# EAGLE design ASL1003 (EAGLE 6.3)
DATABASE: ./../../../../../Components/TinyCircuits_Part_Database.txt
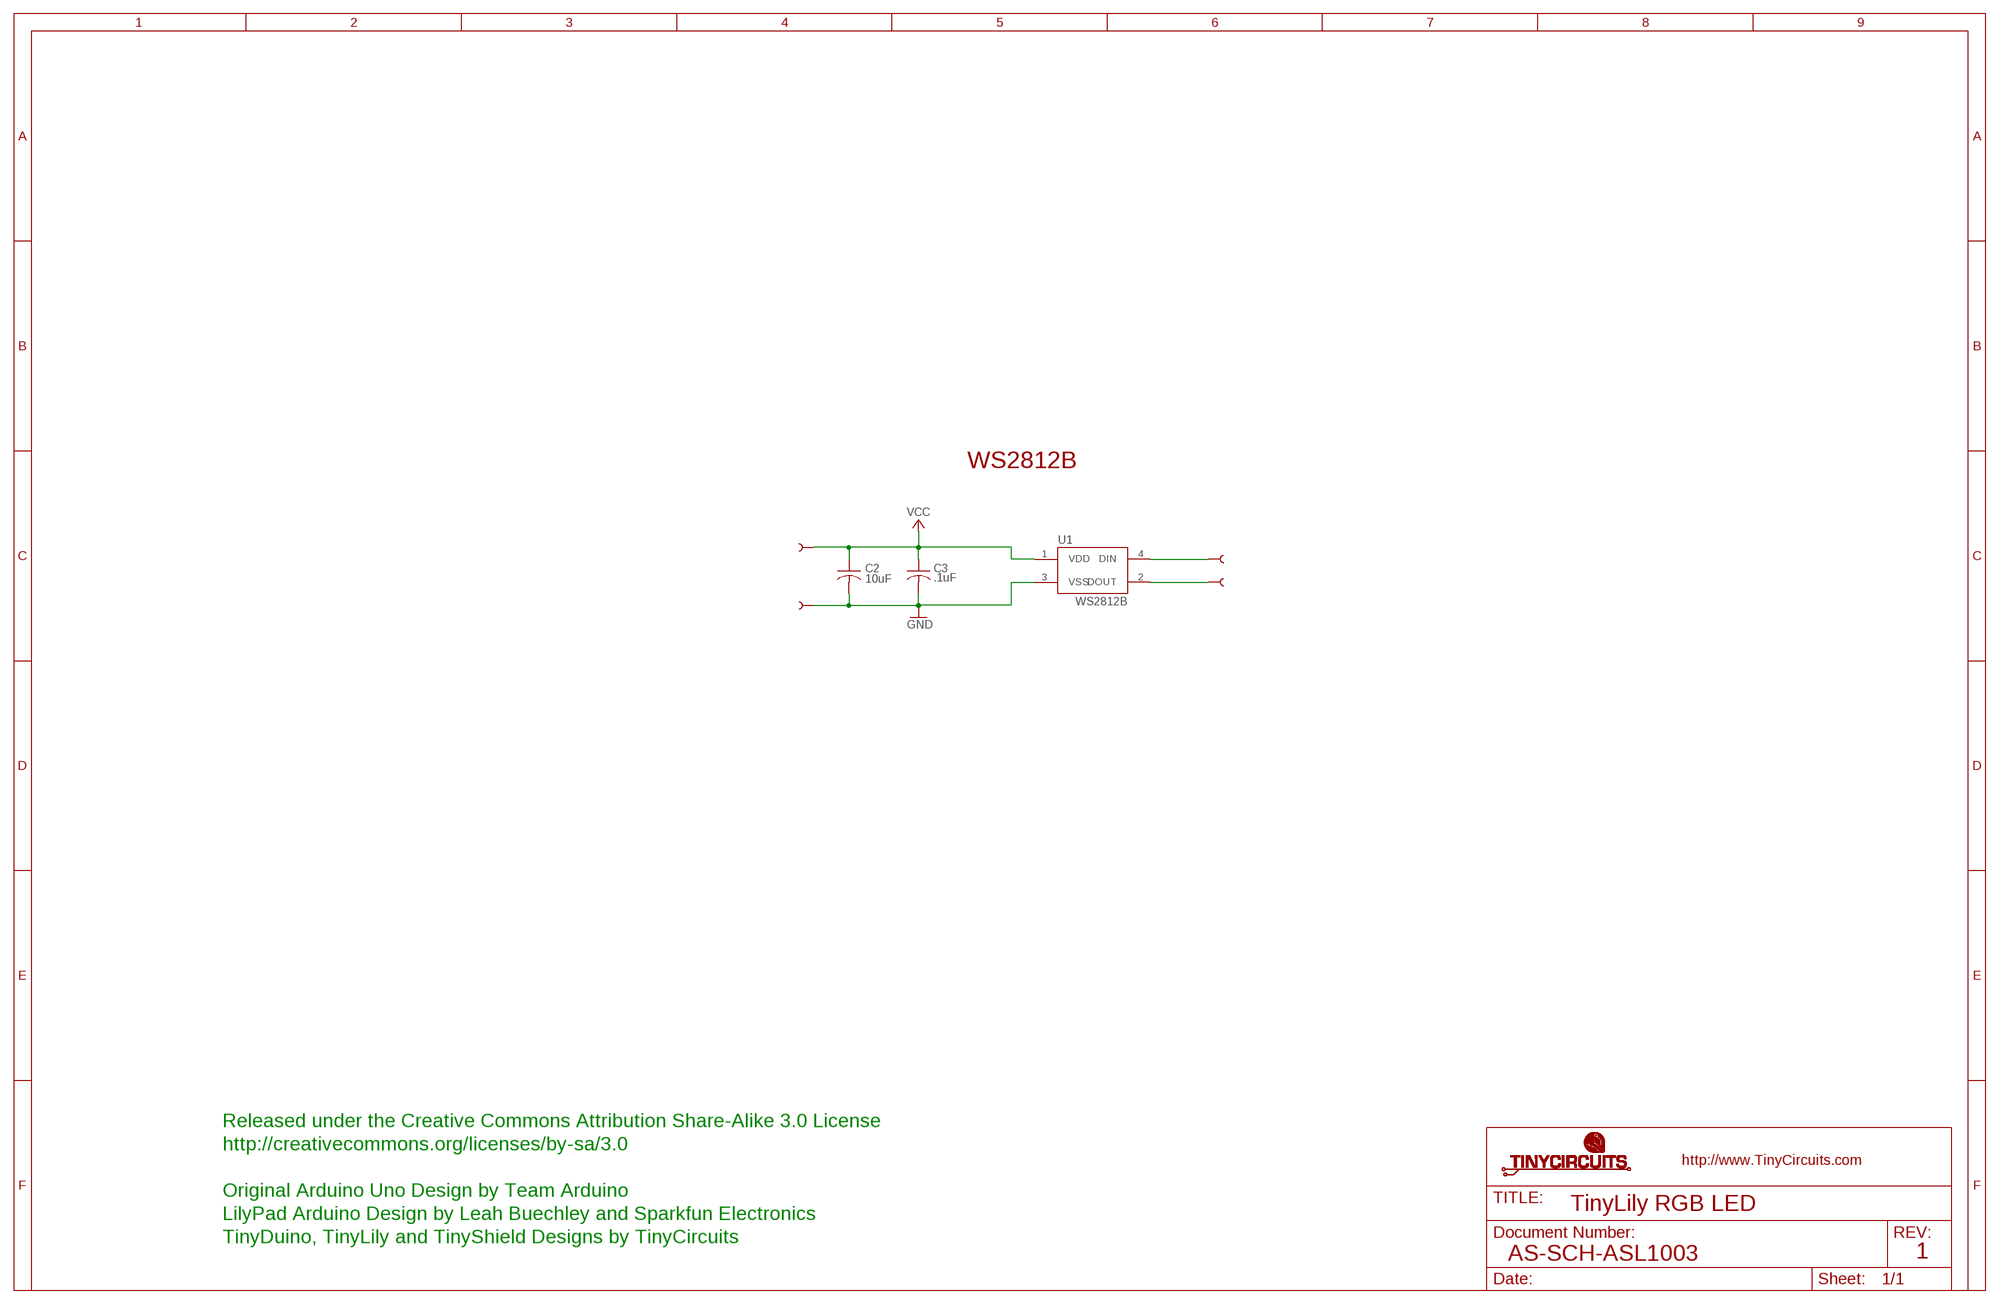
[diagram p0: schematic, sheet 1]

## Parts
C2  10uF  AS-ITM-00002  [C0603]
C3  .1uF  AS-ITM-00008  [C0402]
U1  WS2812B  AS-ITM-00221  [WS2812B]
U$3  SEWTABTH_10MM  [SEWTAP_TH_10MM]
U$7  SEWTABTH_10MM  [SEWTAP_TH_10MM]
U$8  SEWTABTH_10MM  [SEWTAP_TH_10MM]
U$9  SEWTABTH_10MM  [SEWTAP_TH_10MM]

## Nets
GND: C2.2 C3.2 U1.3(VSS) U$7.1
N$2: U1.4(DIN) U$3.1
N$3: U1.2(DOUT) U$9.1
VCC: C2.1 C3.1 U1.1(VDD) U$8.1

## Notes on the sheet
- WS2812B
- Released under the Creative Commons Attribution Share-Alike 3.0 License
- http://creativecommons.org/licenses/by-sa/3.0
- Original Arduino Uno Design by Team Arduino
- TinyLily RGB LED
- LilyPad Arduino Design by Leah Buechley and Sparkfun Electronics
- TinyDuino, TinyLily and TinyShield Designs by TinyCircuits
- AS-SCH-ASL1003 | 1

## Library data of the parts
C2 = tinycircuits:AS-ITM-00002: CAP CER 10UF 10V 20% X5R 0603; PARTNO: AS-ITM-00002
C3 = tinycircuits:AS-ITM-00008: CAP CER 0.1UF 16V 10% X5R 0402; PARTNO: AS-ITM-00008; VALUE: 0.1uF
U1 = tinycircuits:AS-ITM-00221: RGB LED WITH DRIVER; PARTNO: AS-ITM-00221
U$3 U$7-U$9 = tinycircuits:SEWTAB: TinyLily Sew Tab; BOM: EXCLUDE; DNP: T

## Board
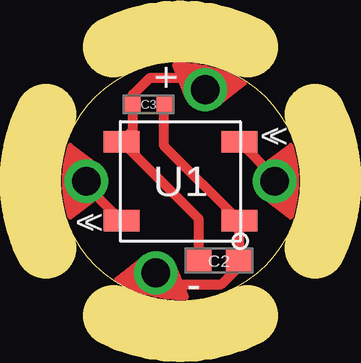
[diagram p1: board, top side]
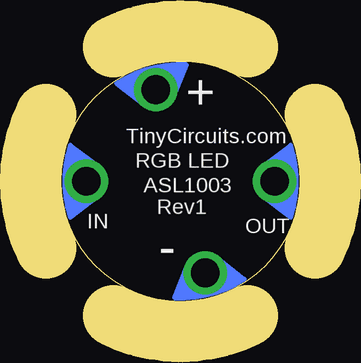
[diagram p2: board, bottom side, seen from below]

Size 10 x 10 mm. Coordinates in mm from the lower left corner, seen from the top.
Outline: 0,5 arc-180 10,5 arc-180 0,5
Copper layers (1*16): Top 0.035mm / dielectric 1.5mm / Bottom 0.035mm
Design rules "default": minimum track width 8mil, minimum drill 15mil, track to track 6mil, track to pad 6mil, pad to pad 6mil, via to via 6mil, smd to smd 6mil, copper to edge 6mil, drill to drill 8mil, minimum pad ring 8mil, minimum via ring 5mil, stop-mask expansion 4mil, vias tented up to drill 25mil, thermal gap 10mil
Milling: 4 lines

### Footprints (pad centres in the part's own frame; a part is rotated, then mirrored left to right if it is on the bottom)
C0603 = smd 1.1 x 1: 1 -0.85,0; 2 0.85,0
C0402 = smd 0.65 x 0.6: 1 -0.65,0; 2 0.65,0
WS2812B = smd 1.5 x 0.9: 1 -2.45,1.65; 2 -2.45,-1.65; 3 2.45,-1.65; 4 2.45,1.65
SEWTAP_TH_10MM = drill 1.2 pad 1.803: 1 -0.127,0

### Placement (x,y rotation side)
C2  6.6,1.7 0 top
C3  3.67,8.21 0 top
U1  5,5 0 top
U$3  8.8,5 180 top
U$6  [DOCFIELD-TINYCIRCUITS-PCB]  29,-15 0 top  (outside the outline)
U$7  4,1.3 75 top
U$8  6,8.7 255 top
U$9  1.2,5 0 top

### Tracks (layer width: path | path; a pad name or v marks a point on that pad's centre or on a via)
GND
  Top 0.406: U$7.1 4.44,0.7 6.7,0.7 7.45,1.45 C2.2 U1.3 4.32,6.48 C3.2
N$2
  Top 0.406: U1.4 8.93,5.17 U$3.1
N$3
  Top 0.406: U1.2 1.07,4.83 U$9.1
VCC
  Top 0.406: C2.1 5.75,3.45 U1.1 3.02,7.12 C3.1 3.02,8.62 3.7,9.3 5.56,9.3 U$8.1

### Text on the board
tPlace: + | < | < | < | < | -
bPlace: + | TinyCircuits.com | RGB LED | ASL1003 | Rev1 | OUT | IN | -
Document: FABRICATION DRAWING | NOTES: | 1. PRINTED CIRCUIT BOARD MADE FROM NEMA GRADE FR-4 EPOXY LAMINATE | WITH 1 OUNCE COPPER PLATING AND .024 THICKNESS. | 2. ALL DIMENSIONS ARE GIVEN IN INCHES. | 3. CIRCUIT PATHS ARE FOR REFERENCE ONLY. | 4. HOLE SIZES SHOWN ARE FINISHED DIAMETERS AFTER PLATING. | 5. BOARD PLATED USING REFLOW OR SIMILAR METHOD. | 6. BOARD TO HAVE BLUE SOLDER MASK ON PLATED SURFACES USING WET FILM | 7. SILKSCREEN BOARD USING WHITE INK. | SR100 OR SR1010 EPOXY. EQUIVALENT WET OR DRY FILM MAY BE USED. | 8. THE FOLLOWING INFORMATION APPLIES TO THIS BOARD: | * 2 COPPER LAYERS | * .024 BOARD THICKNESS | * REQUIRES TOP SIDE SILKSCREEN | Released under the Creative Commons Attribution Share-Alike 3.0 License | http://creativecommons.org/licenses/by-sa/3.0 | LilyPad Arduino Design by Leah Buechley and Sparkfun Electronics | Original Arduino Uno Design by Team Arduino | TinyDuino, TinyLily and TinyShield Designs by TinyCircuits | TinyLily RGB LED | AS-PCB-ASL1003 | 1